# EAGLE design Inv ctl rev4 (EAGLE 7.5.0)
Connections for LCD, moved Vin to A7
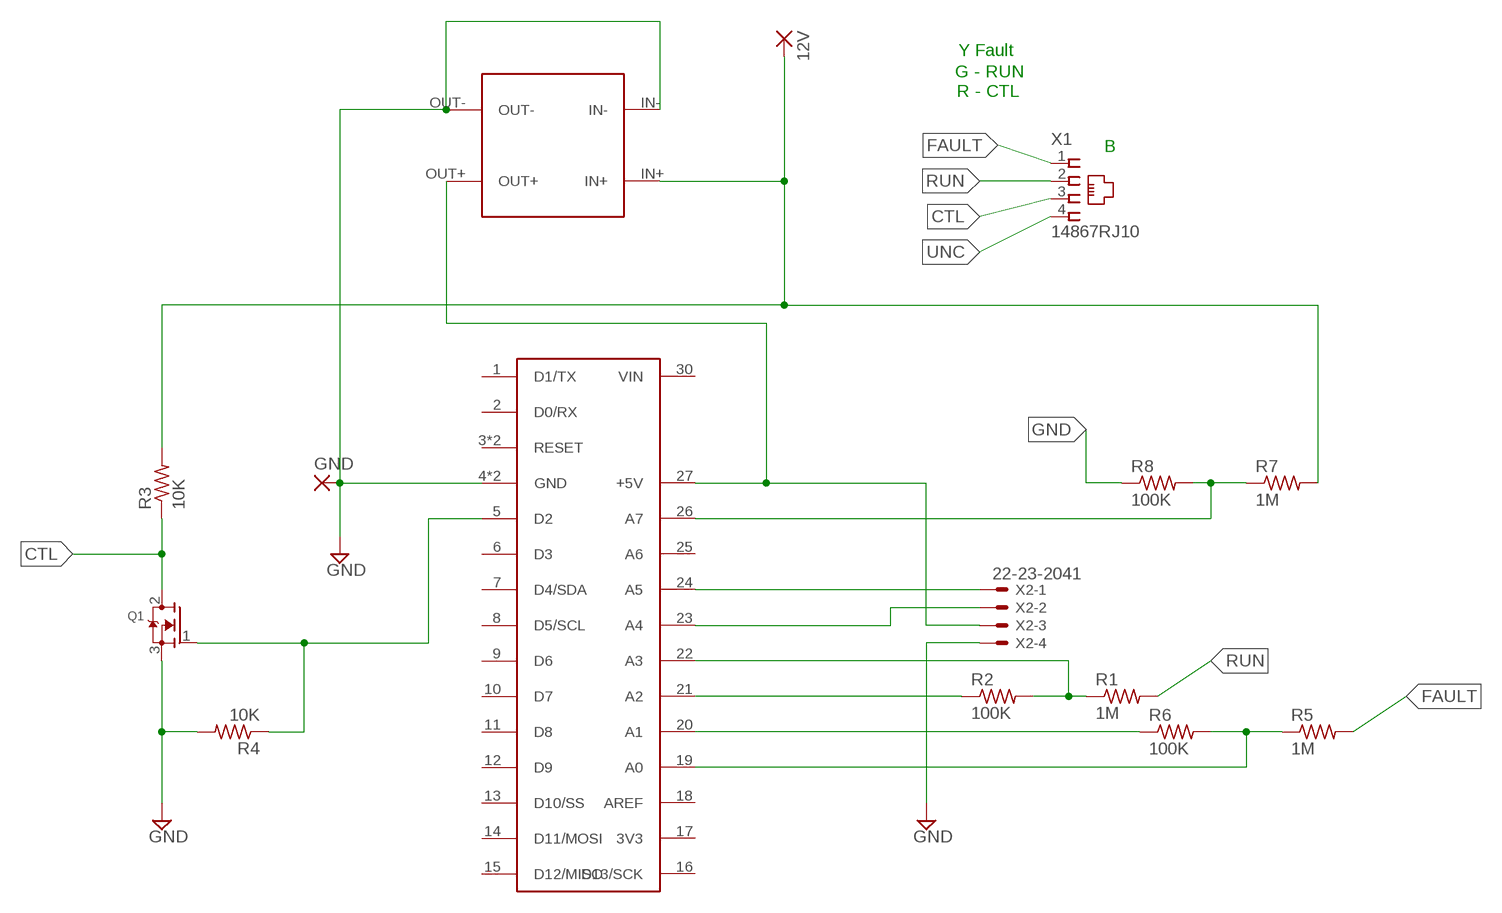
[diagram p0: schematic, sheet 1]

## Parts
12V  3,81/1,4  [3,81/1,4]
GND  3,81/1,4  [3,81/1,4]
Q1  MOSFET-N  [TO252]
R1  1M  R-US_R1206  [R1206]
R2  100K  R-US_R1206  [R1206]
R3  10K  R-US_R0805  [R0805]
R4  10K  R-US_R0805  [R0805]
R5  1M  R-US_R1206  [R1206]
R6  100K  R-US_R1206  [R1206]
R7  1M  R-US_R1206  [R1206]
R8  100K  R-US_R1206  [R1206]
U$1  ARDUINO_NANO  [ARDUINO_NANO]
U$2  LM2956_MODULE  [LM2596_MODULE]
X1  14867RJ10  [RJ10]
X2  22-23-2041  [22-23-2041]

## Nets
12V: 12V.1(P) R3.2 R7.2 U$2.IN+
CTL: Q1.2(D) R3.1 X1.3
FAULT: R5.2 X1.1
GND: GND.1(P) Q1.3(S) R4.2 R8.1 U$1.4(GND) U$1.29(GND) U$2.IN- U$2.OUT- X2.4
LINEVOLTAGE: R7.1 R8.2 U$1.26(A7)
N$6: Q1.1(G) R4.1 U$1.5(D2)
N$7: U$1.27(+5V) U$2.OUT+ X2.3
N$11: R2.1 U$1.21(A2)
N$12: R6.1 U$1.20(A1)
N$13: R5.1 R6.2 U$1.19(A0)
RUN: R1.2 X1.2
RUNMODE: R1.1 R2.2 U$1.22(A3)
SCL: U$1.24(A5) X2.1
SDA: U$1.23(A4) X2.2
UNC: X1.4
Unconnected: U$1.1(D1/TX) U$1.2(D0/RX) U$1.3(RESET) U$1.6(D3) U$1.7(D4/SDA) U$1.8(D5/SCL) U$1.9(D6) U$1.10(D7) U$1.11(D8) U$1.12(D9) U$1.13(D10/SS) U$1.14(D11/MOSI) U$1.15(D12/MISO) U$1.16(D13/SCK) U$1.17(3V3) U$1.18(AREF) U$1.25(A6) U$1.28(RESET) U$1.30(VIN)

## Notes on the sheet
- Y Fault
- G - RUN
- R - CTL
- B

## Library data of the parts
12V GND = wirepad:3,81/1,4: THROUGH-HOLE PAD
Q1 = tsimon:MOSFET-N: N-Channel Mosfet 2N7002E - 60V 260mA SOT23 [Digikey: 2N7002ET1GOSTR-ND] - REEL BSH103 - 30V 850mA SOT23 [Digikey: 568-5013-1-ND]
R1-R8 = resistor:R-US_: RESISTOR, American symbol
U$1 = Arduino_Nano2:ARDUINO_NANO
U$2 = tsimon:LM2956_MODULE
X1 = con-4ucon:14867: RJ11 Connector Source: 4UCON TECHNOLOGY INC. 14867.pdf
X2 = con-molex:22-23-2041: .100" (2.54mm) Center Header - 4 Pin; MF: MOLEX; MPN: 22-23-2041; OC_FARNELL: 1462920; OC_NEWARK: 38C0355

## Board
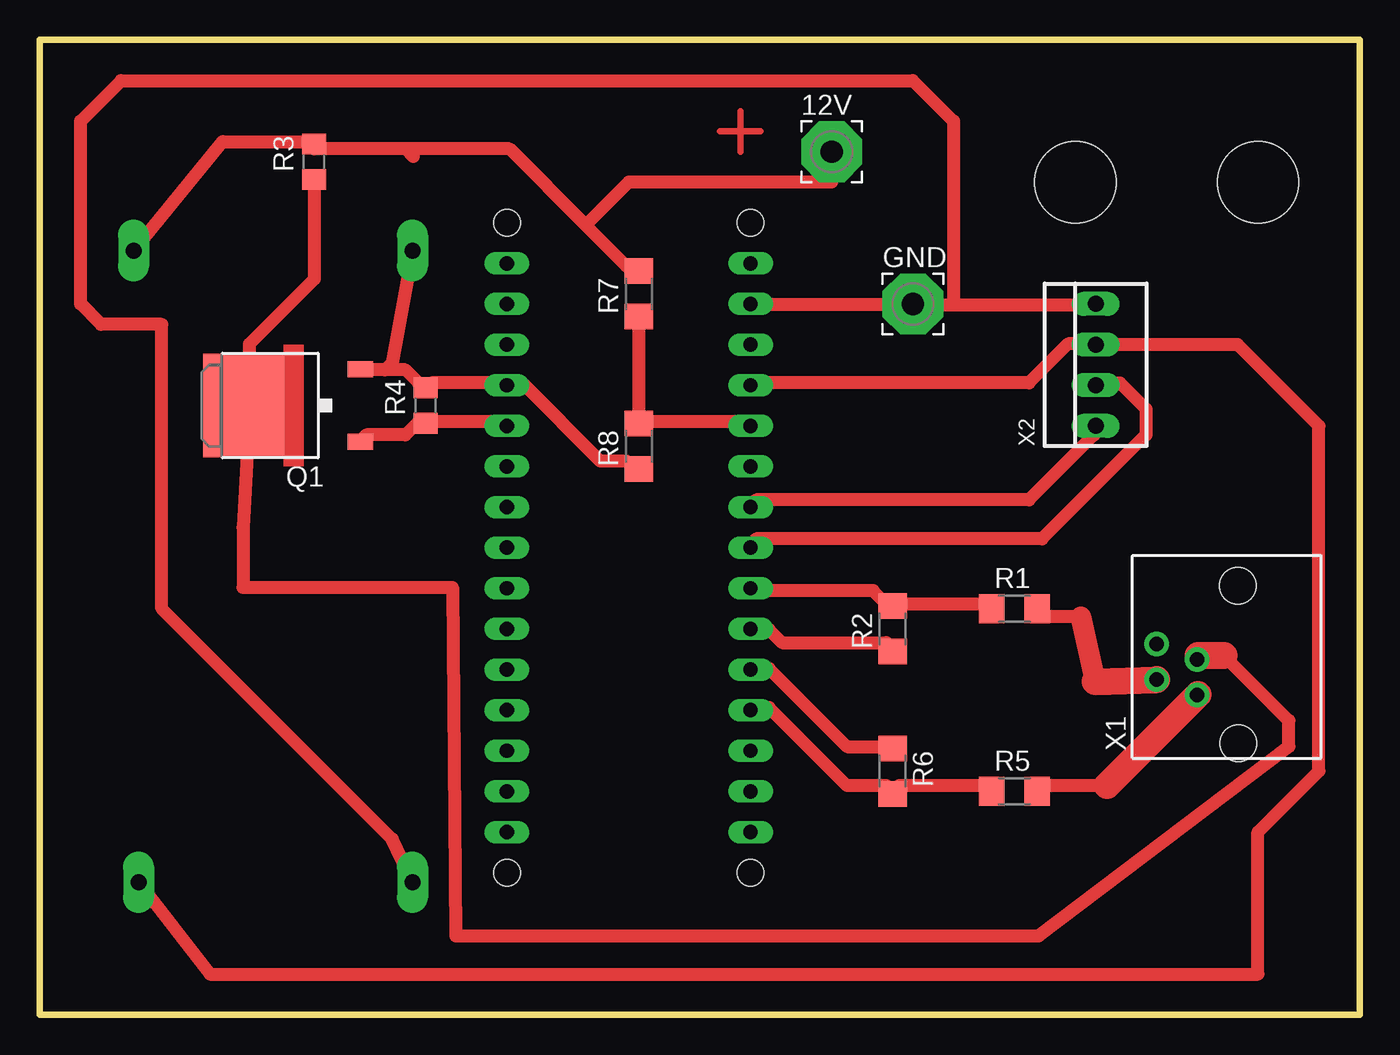
[diagram p1: board, top side]
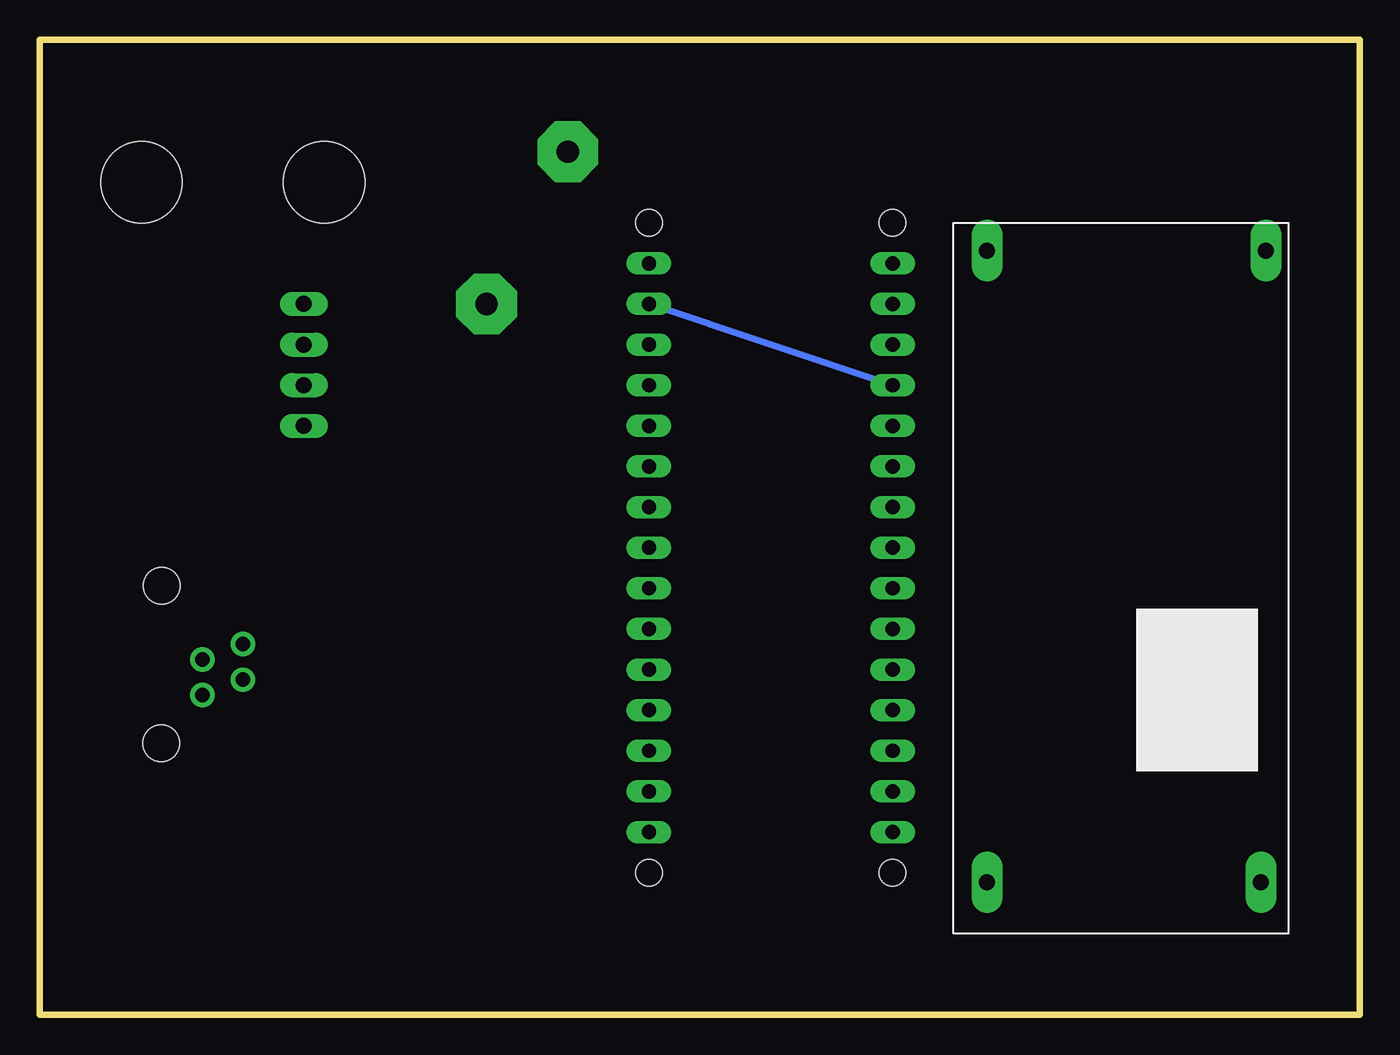
[diagram p2: board, bottom side, seen from below]

Size 82.55 x 60.96 mm. Coordinates in mm from the lower left corner, seen from the top.
Outline: 82.55,0 0,0 0,60.96 82.55,60.96 82.55,0
Copper layers (1*16): Top 0.035mm / dielectric 1.5mm / Bottom 0.035mm
Design rules "default *": minimum track width 32mil, minimum drill 32mil, track to track 32mil, track to pad 32mil, pad to pad 32mil, via to via 32mil, smd to smd 32mil, copper to edge 40mil, drill to drill 8mil, minimum pad ring 10mil, minimum via ring 8mil, stop-mask expansion 4mil, vias tented up to drill 0mil, thermal gap 10mil
Holes 5.08 mm at 76.2,52.07 64.77,52.07

### Footprints (pad centres in the part's own frame; a part is rotated, then mirrored left to right if it is on the bottom)
3,81/1,4 = drill 1.397 pad 3.81 octagon: 1 0,0
TO252 = smd 1 x 1.6: 1 -2.28,-4.8; 3 2.28,-4.8 | smd 6.452 x 5.08: 2 0,2.5
R1206 = smd 1.6 x 1.803: 1 -1.422,0; 2 1.422,0
R0805 = smd 1.3 x 1.5: 1 -1.109,0; 2 1.109,0
ARDUINO_NANO = drill 0.9 long: 1 -7.62,17.78; 2 -7.62,15.24; 3 -7.62,12.7; 4 -7.62,10.16; 5 -7.62,7.62; 6 -7.62,5.08; 7 -7.62,2.54; 8 -7.62,0; 9 -7.62,-2.54; 10 -7.62,-5.08; 11 -7.62,-7.62; 12 -7.62,-10.16; 13 -7.62,-12.7; 14 -7.62,-15.24; 15 -7.62,-17.78; 16 7.62,-17.78; 17 7.62,-15.24; 18 7.62,-12.7; 19 7.62,-10.16; 20 7.62,-7.62; 21 7.62,-5.08; 22 7.62,-2.54; 23 7.62,0; 24 7.62,2.54; 25 7.62,5.08; 26 7.62,7.62; 27 7.62,10.16; 28 7.62,12.7; 29 7.62,15.24; 30 7.62,17.78 | hole 1.651: -7.62,-20.32; 7.62,-20.32; 7.62,20.32; -7.62,20.32
LM2596_MODULE = drill 1 pad 1.93 long: IN+ 1.743,19.537; IN- 1.744,2.09; OUT+ 41.24,19.236; OUT- 41.24,2.089
RJ10 = drill 0.9 pad 1.524: 1 -1.587,6.35; 2 -0.635,8.89; 3 0.635,6.35; 4 1.587,8.89 | hole 2.286: -4.614,3.769; 5.239,3.81
22-23-2041 = drill 1 long: 1 -3.81,0; 2 -1.27,0; 3 1.27,0; 4 3.81,0

### Placement (x,y rotation side)
12V  49.53,53.98 0 top
GND  54.61,44.45 0 top
Q1  15.24,38.1 90 top
R1  60.96,25.4 0 top
R2  53.34,24.13 90 top
R3  17.14,53.34 90 top
R4  24.13,38.1 90 top
R5  60.96,13.97 0 top
R6  53.34,15.24 270 top
R7  37.46,45.09 90 top
R8  37.46,35.56 90 top
U$1  36.83,29.21 0 top
U$2  25.4,49.53 270 bottom
X1  78.74,21.59 90 top
X2  66.04,40.64 90 top

### Tracks (layer width: path | path; a pad name or v marks a point on that pad's centre or on a via)
12V
  Top 0.813: 22.86,54.15 29.36,54.15 34.14,49.38 | 22.86,54.15 17.17,54.15 R3.2 16.98,54.61 11.43,54.61 5.88,47.79 U$2.IN+ | 34.14,49.38 36.68,46.84 R7.2 | 23.35,53.67 22.86,54.15 | 12V.1 49.53,52.07 36.83,52.07 34.14,49.38
CTL
  Top 0.813: R3.1 17.17,51.71 17.17,46.03 13.11,41.96 13.11,38.71 Q1.2 13.11,37.9 12.7,30.48 12.7,26.72 25.81,26.72 26.01,4.93 62.48,4.93 78.13,16.76 78.13,18.39 74.07,22.45 | 72.44,22.45 X1.3
  Top 1.676: 74.07,22.45 72.44,22.45
FAULT
  Top 0.813: 66.75,14.33 62.69,14.33 R5.2 | 72.44,20.02 X1.1
  Top 1.676: 72.44,20.02 66.75,14.33
GND
  Top 0.813: 21.59,40.34 22.86,40.34 23.67,39.52 R4.2 24.49,39.52 28.55,39.52 U$1.4 29.36,39.52 30.18,39.52 35.05,34.65 36.68,34.65 R8.1 | 21.59,40.34 20.42,40.34 Q1.3 | 43.99,44.4 U$1.29 44.81,44.4 54.56,44.4 GND.1 55.37,44.4 57.15,44.4 | 57.15,44.4 65.94,44.4 X2.4 | U$2.IN- 22.04,40.79 21.59,40.34 | U$2.OUT- 22.04,10.98 7.62,25.4 7.62,43.18 3.81,43.18 2.54,44.45 2.54,55.88 5.08,58.42 54.61,58.42 57.15,55.88 57.15,44.4
  Bottom 0.406: U$1.4 U$1.29
LINEVOLTAGE
  Top 0.813: 37.49,37.08 43.99,37.08 U$1.26 | 37.49,37.08 37.49,43.59 R7.1 | 37.49,37.08 R8.2
N$6
  Top 0.813: U$1.5 28.55,37.08 24.49,37.08 R4.1 23.67,37.08 22.86,36.27 20.42,36.27 Q1.1
N$7
  Top 0.813: U$1.27 44.81,39.52 61.87,39.52 64.31,41.96 65.94,41.96 X2.3 74.93,41.91 80.01,36.83 80.01,15.24 76.2,11.43 76.2,2.54 10.64,2.54 U$2.OUT+
N$11
  Top 0.813: R2.1 52.93,23.27 46.43,23.27 45.62,24.08 44.81,24.08 U$1.21
N$12
  Top 0.813: R6.1 52.93,16.76 50.49,16.76 45.62,21.64 44.81,21.64 U$1.20
N$13
  Top 0.813: R5.1 59.44,14.33 53.75,14.33 R6.2 52.93,14.33 50.49,14.33 45.62,19.2 44.81,19.2 U$1.19
N$14
  Top 0.406: 42.55,55.25 43.81,55.25 | 45.09,55.25 43.81,55.25 | 43.81,55.25 43.81,53.98 | 43.81,55.25 43.81,56.52
RUN
  Top 0.813: 65.13,24.89 62.69,24.89 R1.2
  Top 1.27: 66.02,20.83 65.13,24.89
  Top 1.676: 66.02,20.83 X1.2
RUNMODE
  Top 0.813: R1.1 59.44,25.71 53.75,25.71 R2.2 52.93,25.71 52.12,26.52 44.81,26.52 U$1.22
SCL
  Top 0.813: U$1.24 44.81,32.21 61.87,32.21 65.94,36.27 X2.1
SDA
  Top 0.813: U$1.23 44.81,29.77 62.69,29.77 69.19,36.27 69.19,37.9 67.56,39.52 66.75,39.52 X2.2
(copper drawn outside any net)
  shapes: Top area x1